# EAGLE design сharger_lm317_tl431_3 (EAGLE 5.10)
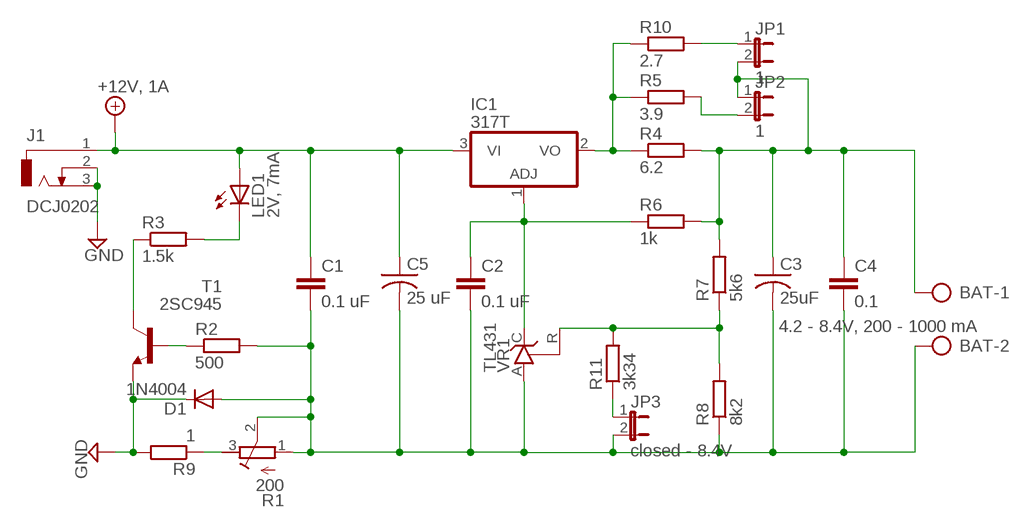
[diagram p0: schematic, sheet 1]

## Parts
BAT  4.2 - 8.4V, 200 - 1000 mA  AK300/2  [AK300/2]
C1  0.1 uF  C-EU025-050X050  [C025-050X050]
C2  0.1 uF  C-EU025-050X050  [C025-050X050]
C3  25uF  C-US025-050X050  [C025-050X050]
C4  0.1  C-EU025-050X050  [C025-050X050]
C5  25 uF  C-US025-050X050  [C025-050X050]
D1  1N4004  [DO41-10]
IC1  317T  [TO220H]
J1  DCJ0202  [DCJ0202]
JP1  1  JP1E  [JP1]
JP2  1  JP1E  [JP1]
JP3  closed - 8.4V  JP1E  [JP1]
LED1  2V, 7mA  LED5MM  [LED5MM]
R1  200  R-TRIMM3296W  [RTRIM3296W]
R2  500  R-EU_0207/10  [0207/10]
R3  1.5k  R-EU_0207/10  [0207/10]
R4  6.2  R-EU_0617/22  [0617/22]
R5  3.9  R-EU_0617/22  [0617/22]
R6  1k  R-EU_0207/10  [0207/10]
R7  5k6  R-EU_0207/10  [0207/10]
R8  8k2  R-EU_0207/10  [0207/10]
R9  1  R-EU_0207/10  [0207/10]
R10  2.7  R-EU_0617/22  [0617/22]
R11  3k34  R-EU_0207/10  [0207/10]
T1  2SC945  [TO92-ECB]
VR1  TL431  TL431CLP  [TO92-CLP]

## Nets
+12V: C1.1 C5.1 IC1.3(VI) J1.1 LED1.A ; supply symbol labelled +12V, 1A
GND: D1.C J1.2 J1.3 R9.2 T1.E
N$1: JP1.1 R10.2
N$2: C2.1 IC1.1(ADJ) R6.1 VR1.C
N$3: R7.1 R8.2 R11.2 VR1.R
N$4: R3.1 T1.C
N$6: JP2.2 R5.2
N$7: BAT.1 C3.1 C4.1 JP1.2 JP2.1 R4.2 R6.2 R7.2
N$8: R1.3(A) R9.1
N$9: R2.1 T1.B
N$10: LED1.K(C) R3.2
N$11: JP3.1 R11.1
N$12: IC1.2(VO) R4.1 R5.1 R10.1
N$15: BAT.2 C1.2 C2.2 C3.2 C4.2 C5.2 D1.A JP3.2 R1.1(E) R1.2(S) R2.2 R8.1 VR1.A

## Library data of the parts
BAT = con-ptr500:AK300/2: CONNECTOR
C1 C2 C4 = resistor:C-EU: CAPACITOR, European symbol
C3 C5 = resistor:C-US: CAPACITOR, American symbol
D1 = diode:1N4004: DIODE general purpose rectifier, 1 A
IC1 = linear:*317: Positive VOLTAGE REGULATOR
J1 = con-jack:DCJ0202: DC POWER JACK Source: DCJ0202.pdf
JP1-JP3 = jumper:JP1E: JUMPER
LED1 = led:LED: LED OSRAM: - CHIPLED LG R971, LG N971, LY N971, LG Q971, LY Q971, LO R971, LY R971 LH N974, LH R974 LS Q976, LO Q976, LY Q976 LO Q996 - Hyper CHIPLED LW Q18S LB Q993, LB Q99A, LB R99A - SideLED LS A670, LO A670, LY A670, LG A670, LP A670 LB A673, LV A673, LT A673, LW A673 LH A674 LY A675 LS A676, LA A676, LO A676, LY A676, LW A676 LS A679, LY A679, LG A679 - Hyper Micro SIDELED® LS Y876, LA Y876, LO Y876, LY Y876 LT Y87S - SmartLED LW L88C, LW L88S LB L89C, LB L89S, LG L890 LS L89K, LO L89K, LY L89K LS L896, LA L896, LO L896, LY L896 - TOPLED LS T670, LO T670, LY T670, LG T670, LP T670 LSG T670, LSP T670, LSY T670, LOP T670, LYG T670 LG T671, LOG T671, LSG T671 LB T673, LV T673, LT T673, LW T673 LH T674 LS T676, LA T676, LO T676, LY T676, LB T676, LH T676, LSB T676, LW T676 LB T67C, LV T67C, LT T67C, LS T67K, LO T67K, LY T67K, LW E67C LS E67B, LA E67B, LO E67B, LY E67B, LB E67C, LV E67C, LT E67C LW T67C LS T679, LY T679, LG T679 LS T770, LO T770, LY T770, LG T770, LP T770 LB T773, LV T773, LT T773, LW T773 LH T774 LS E675, LA E675, LY E675, LS T675 LS T776, LA T776, LO T776, LY T776, LB T776 LHGB T686 LT T68C, LB T68C - Hyper Mini TOPLED® LB M676 - Mini TOPLED Santana® LG M470 LS M47K, LO M47K, LY M47K Source: http://www.osram.convergy.de LUXEON: - LUMILED® LXK2-PW12-R00, LXK2-PW12-S00, LXK2-PW14-U00, LXK2-PW14-V00 LXK2-PM12-R00, LXK2-PM12-S00, LXK2-PM14-U00 LXK2-PE12-Q00, LXK2-PE12-R00, LXK2-PE12-S00, LXK2-PE14-T00, LXK2-PE14-U00 LXK2-PB12-K00, LXK2-PB12-L00, LXK2-PB12-M00, LXK2-PB14-N00, LXK2-PB14-P00, LXK2-PB14-Q00 LXK2-PR12-L00, LXK2-PR12-M00, LXK2-PR14-Q00, LXK2-PR14-R00 LXK2-PD12-Q00, LXK2-PD12-R00, LXK2-PD12-S00 LXK2-PH12-R00, LXK2-PH12-S00 LXK2-PL12-P00, LXK2-PL12-Q00, LXK2-PL12-R00 Source: www.luxeon.com KINGBRIGHT: KA-3528ASYC Source: www.kingbright.com
R1 = resistor:R-TRIMM: Trimm resistor
R2 R4-R11 = resistor:R-EU_: RESISTOR, European symbol
R3 = rcl:R-EU_: RESISTOR, European symbol
T1 = transistor:2SC945: NPN Silicon Epitaxial Planar Transistor Source: SEMTECH ELECTRONICS LTD. ... 2SC945 2.pdf
VR1 = v-reg:TL431CLP: VOLTAGE REGULATOR

## Board
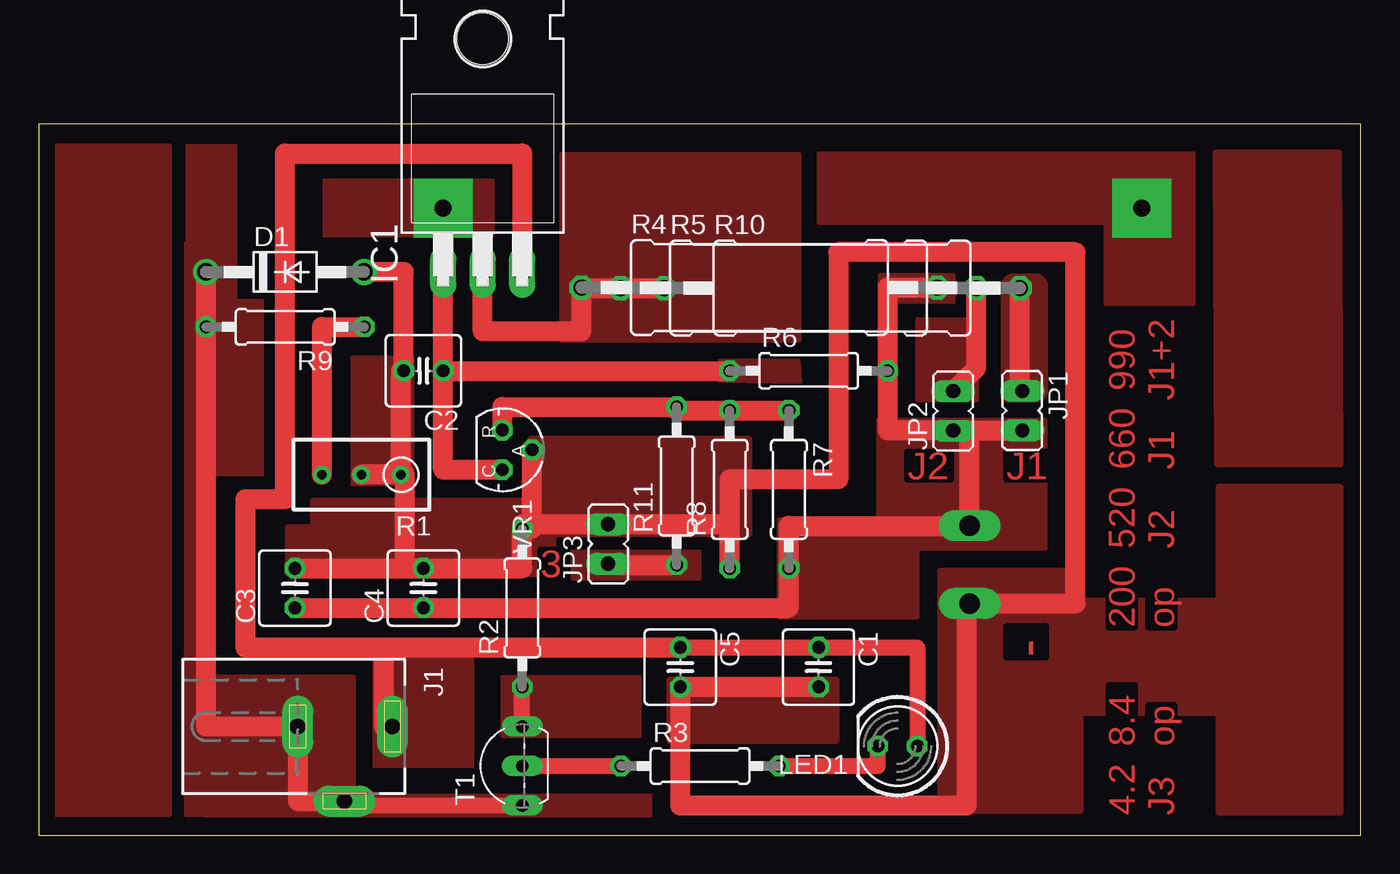
[diagram p1: board, top side]
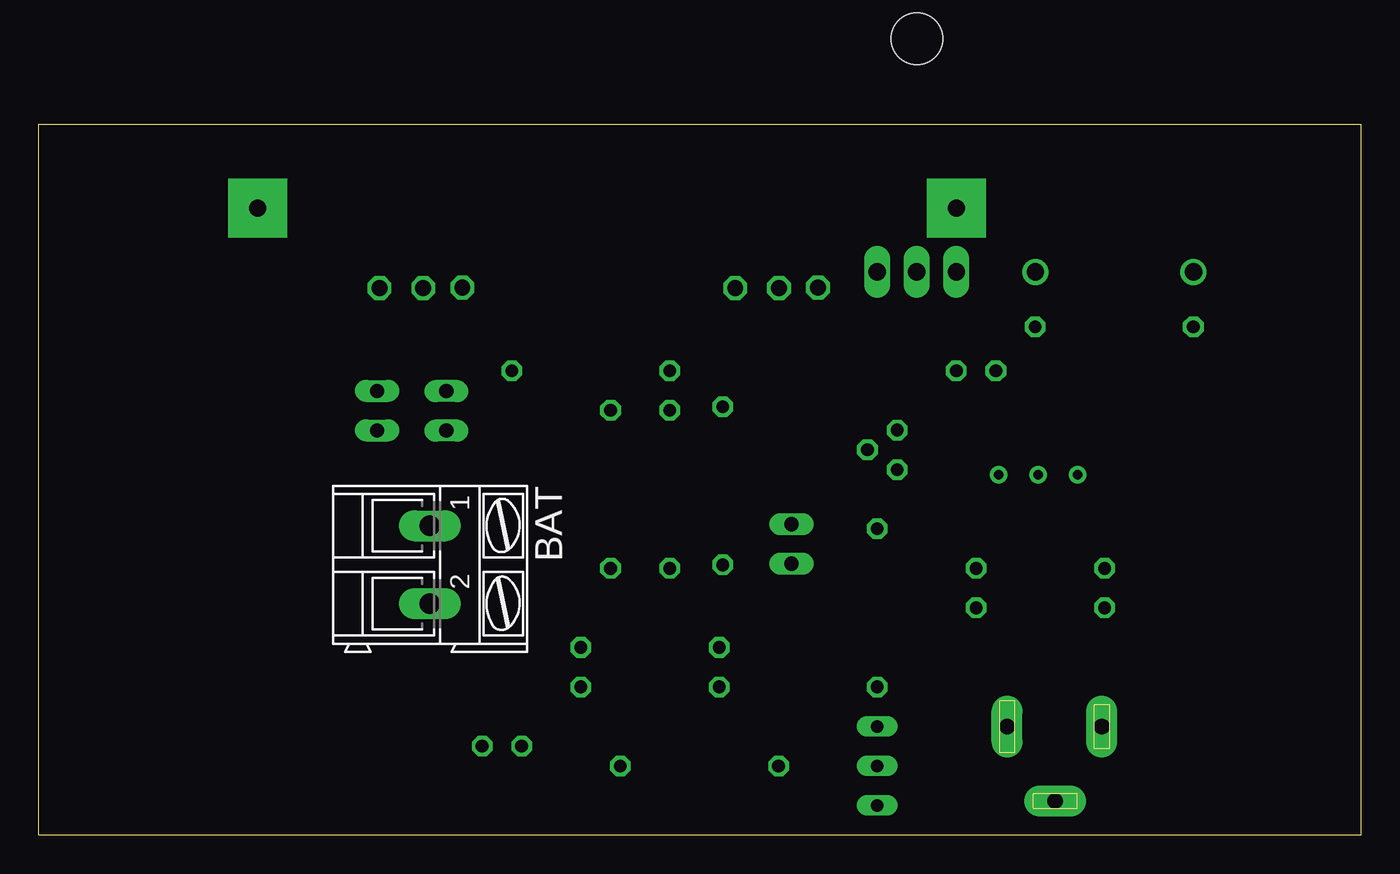
[diagram p2: board, bottom side, seen from below]

Size 84.94 x 45.71 mm. Coordinates in mm from the lower left corner, seen from the top.
Outline: 0,0 84.94,0 84.94,45.71 0,45.71 0,0
Copper layers (1*16): Top 0.035mm / dielectric 1.5mm / Bottom 0.035mm
Design rules "default": minimum track width 10mil, minimum drill 24mil, track to track 8mil, track to pad 8mil, pad to pad 8mil, via to via 8mil, smd to smd 8mil, copper to edge 40mil, drill to drill 8mil, minimum pad ring 10mil, minimum via ring 8mil, stop-mask expansion 4mil, vias tented up to drill 0mil, thermal gap 10mil

### Footprints (pad centres in the part's own frame; a part is rotated, then mirrored left to right if it is on the bottom)
AK300/2 = drill 1.321 long: 1 -2.515,0; 2 2.489,0
C025-050X050 = drill 0.813 octagon: 1 -1.27,0; 2 1.27,0
DO41-10 = drill 1.118 round: A 5.08,0; C -5.08,0
TO220H = drill 1.118 long: 1 -2.54,-10.16; 2 0,-10.16; 3 2.54,-10.16 | hole 3.302: 0,4.826
DCJ0202 = drill 1 pad 2 long: 1 0,3.1; 2 4.8,0; 3 0,-3
JP1 = drill 0.914 long: 1 0,-1.27; 2 0,1.27
LED5MM = drill 0.813 octagon: A -1.27,0; K 1.27,0
RTRIM3296W = drill 0.61 round: 1 0,-2.54; 2 0,0; 3 0,2.54
0207/10 = drill 0.813 octagon: 1 -5.08,0; 2 5.08,0
0617/22 = drill 1.016 octagon: 1 -11.43,0; 2 11.43,0
TO92-ECB = drill 0.813 long: B 2.54,0; C 0,0; E -2.54,0
TO92-CLP = drill 0.813 octagon: A 0,1.905; C 1.27,0; R -1.27,0

### Placement (x,y rotation side)
BAT  59.81,17.37 270 bottom
C1  50.11,10.79 270 top
C2  24.71,29.84 180 top
C3  16.45,15.88 90 top
C4  24.71,15.88 90 top
C5  41.22,10.79 270 top
D1  15.82,36.2 0 top
IC1  28.52,46.36 0 top
J1  19.63,6.99 270 top
JP1  63.2,27.28 180 top
JP2  58.76,27.27 0 top
JP3  36.58,18.71 0 top
LED1  55.19,5.71 180 top
R1  20.73,23.16 90 top
R2  31.06,14.61 90 top
R3  42.49,4.45 0 top
R4  46.3,35.2 0 top
R5  48.81,35.17 0 top
R6  49.48,29.84 0 top
R7  48.2,22.22 270 top
R8  44.4,22.22 90 top
R9  15.83,32.66 180 top
R10  51.62,35.16 0 top
R11  40.98,22.45 90 top
T1  31.06,4.45 90 top
VR1  29.79,24.76 270 top

### Tracks (layer width: path | path; a pad name or v marks a point on that pad's centre or on a via)
+12V
  Top 1.016: C5.1 C1.1 56.46,12.06 LED1.A
  Top 1.27: IC1.3 31.06,43.82 15.82,43.82 15.82,21.59 13.28,21.59 13.28,12.06 22.17,12.06 | 22.17,12.06 C5.1 | J1.1 22.17,6.99 22.17,12.06
  pour Top (no thermals): 21.54,12.06 21.54,4.45 27.88,4.45 27.88,12.06
GND
  Top 1.016: 19.8,2.04 19.8,1.91 T1.E
  Top 1.27: 19.8,2.04 J1.2 16.63,2.18 J1.3 10.75,6.99 R9.2 D1.C
  pour Top (no thermals): 10.74,1.27 39.31,1.27 39.31,2.54 20.27,2.54 20.27,10.16 10.74,10.16
  pour Top (no thermals): 9.54,44.3 9.54,34.36 12.64,34.36 12.64,44.3
  pour Top (no thermals): 10.74,1.27 9.47,1.27 9.47,38.1 10.74,38.1
  pour Top (no thermals): 11.23,34.37 14.33,34.37 14.33,23.16 11.23,23.16
N$1
  Top 1.27: R10.2 63.05,28.7 JP1.1
  pour Top (no thermals): 62.17,27.94 arc-90 61.94,28.57 61.94,35.06 arc-90 62.58,36 64.08,36 arc-90 64.72,35.16 64.72,28.57 arc-90 64.08,27.94
N$2
  Top 1.27: C2.1 IC1.1 | C2.1 25.98,23.49 VR1.C | C2.1 R6.1
  pour Top (no thermals): 43.76,30.48 43.76,29.21 48.94,29.11 48.84,30.48
N$3
  Top 1.27: VR1.R 29.79,27.53 R11.2 40.98,27.3 R8.2 R7.1
N$4
  Top 1.016: T1.C R3.1
N$5
  pour Top (no thermals): 0.83,44.27 8.33,44.27 8.33,1.36 0.83,1.36
N$6
  Top 1.27: R5.2 60.24,30.02 JP2.2
  pour Top (no thermals): 60.27,33.16 60.27,27.94 56.46,27.94 56.46,33.16
N$7
  Top 1.27: C3.1 C4.1 48.2,14.61 R7.2 48.2,19.88 BAT.1 59.81,26 JP2.1 | R4.2 54.55,35.2 R6.2 54.55,26.01 JP2.1 | JP2.1 JP1.2
  pour Top (no thermals): 47.57,20.32 56.46,20.32 56.46,13.97 47.57,13.97
  pour Top (no thermals): 64.72,26.67 53.92,26.67 53.92,18.41 64.72,18.41
  pour Top (no thermals): 54.02,36 54.02,34.29 58.8,34.29 58.8,36
N$8
  Top 1.27: R1.3 18.19,32.66 R9.1
N$9
  Top 1.016: T1.B R2.1
  pour Top (no thermals): 29.79,6.35 29.79,10.16 38.61,10.16 38.61,6.35
N$10
  Top 1.016: R3.2 53.92,4.45 LED1.K
N$11
  Top 1.27: JP3.1 36.58,17.37 R11.1
  pour Top (no thermals): 42.49,18.21 34.28,18.21 34.28,16.51 42.49,16.51
N$12
  Top 1.27: IC1.2 28.52,32.39 34.87,32.39 R4.1 34.87,35.17 R5.1 R10.1
  pour Top (no thermals): 33.6,31.75 33.6,43.82 48.84,43.82 48.84,31.75
N$13  (via drill 1.1 pad 3.81)
  other vias: 25.98,40.3
  pour Top (no thermals): 29.16,38.55 18.36,38.55 18.36,42.11 29.16,42.11
N$14  (via drill 1.1 pad 3.81)
  other vias: 70.88,40.3
  pour Top (no thermals): 74.24,43.82 50.11,43.82 50.11,39.37 68.53,39.37 68.53,34.16 74.24,34.16
N$15
  Top 1.27: C1.2 C5.2 41.22,1.91 59.63,1.91 59.63,14.88 BAT.2 66.62,14.88 66.62,37.47 51.38,37.47 51.38,22.86 44.4,22.86 R8.1 44.4,19.98 JP3.2 31.06,19.98 | 31.7,19.68 VR1.A | C3.2 23.53,17.14 | 23.53,17.14 C4.2 | C4.2 23.99,17.14 | D1.A 23.44,36.2 C2.2 23.27,29.84 R1.1 | R1.1 R1.2 | R1.1 23.53,23.16 23.53,17.14 | C4.2 31.06,17.14 R2.2
  pour Top (no thermals): 24.03,30.66 20.13,30.66 20.13,22.56 24.03,22.56
  pour Top (no thermals): 31.73,25.46 45.63,25.46 45.63,19.36 31.63,19.36 31.63,25.46
  pour Top (no thermals): 57.93,16.96 66.93,16.96 66.93,1.57 57.93,1.57
  pour Top (no thermals): 40.53,9.96 51.23,9.96 51.23,6.07 40.53,6.07
  pour Top (no thermals): 16.03,19.76 17.63,19.76 17.63,21.46 33.03,21.46 33.03,16.76 16.03,16.86
  pour Top (no thermals): 66.03,15.06 76.63,15.06 76.63,7.87 65.93,7.87 65.93,15.17 66.03,15.17
N$16
  pour Top (no thermals): 75.63,43.87 83.53,43.87 83.63,23.86 75.73,23.86
N$17
  pour Top (no thermals): 75.83,22.36 83.63,22.36 83.63,1.47 75.83,1.47

### Text on the board
Top: 990 | J1+2 | 660 | J1 | J2 | J1 | 520 | J2 | 3 | 200 | op | - | 8.4 | op | 4.2 | J3